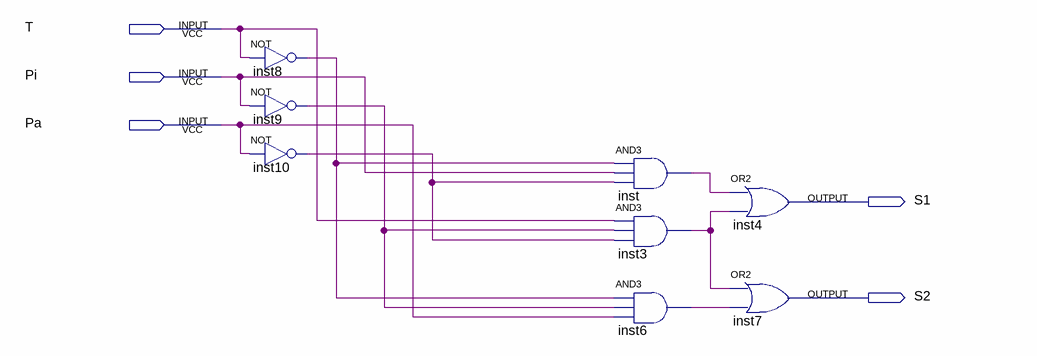
[diagram p0: schematic sheet]
// Quartus schematic CODIFICADOR.bdf as structural Verilog: 8 symbols, 5 pins
module CODIFICADOR (
  input  T,
  input  Pi,
  input  Pa,
  output S1,
  output S2
);

  wire inst3_out, inst6_out, inst8_out, inst9_out, inst10_out, inst_out;

  not inst8 (inst8_out, T);
  not inst9 (inst9_out, Pi);
  not inst10 (inst10_out, Pa);
  and inst (inst_out, inst8_out, Pi, inst10_out);
  and inst3 (inst3_out, T, inst9_out, inst10_out);
  and inst6 (inst6_out, inst8_out, inst9_out, Pa);
  or inst4 (S1, inst_out, inst3_out);
  or inst7 (S2, inst3_out, inst6_out);
endmodule
